# Altium schematic sheet Sheet_1.schdoc
size 296 x 161 mm
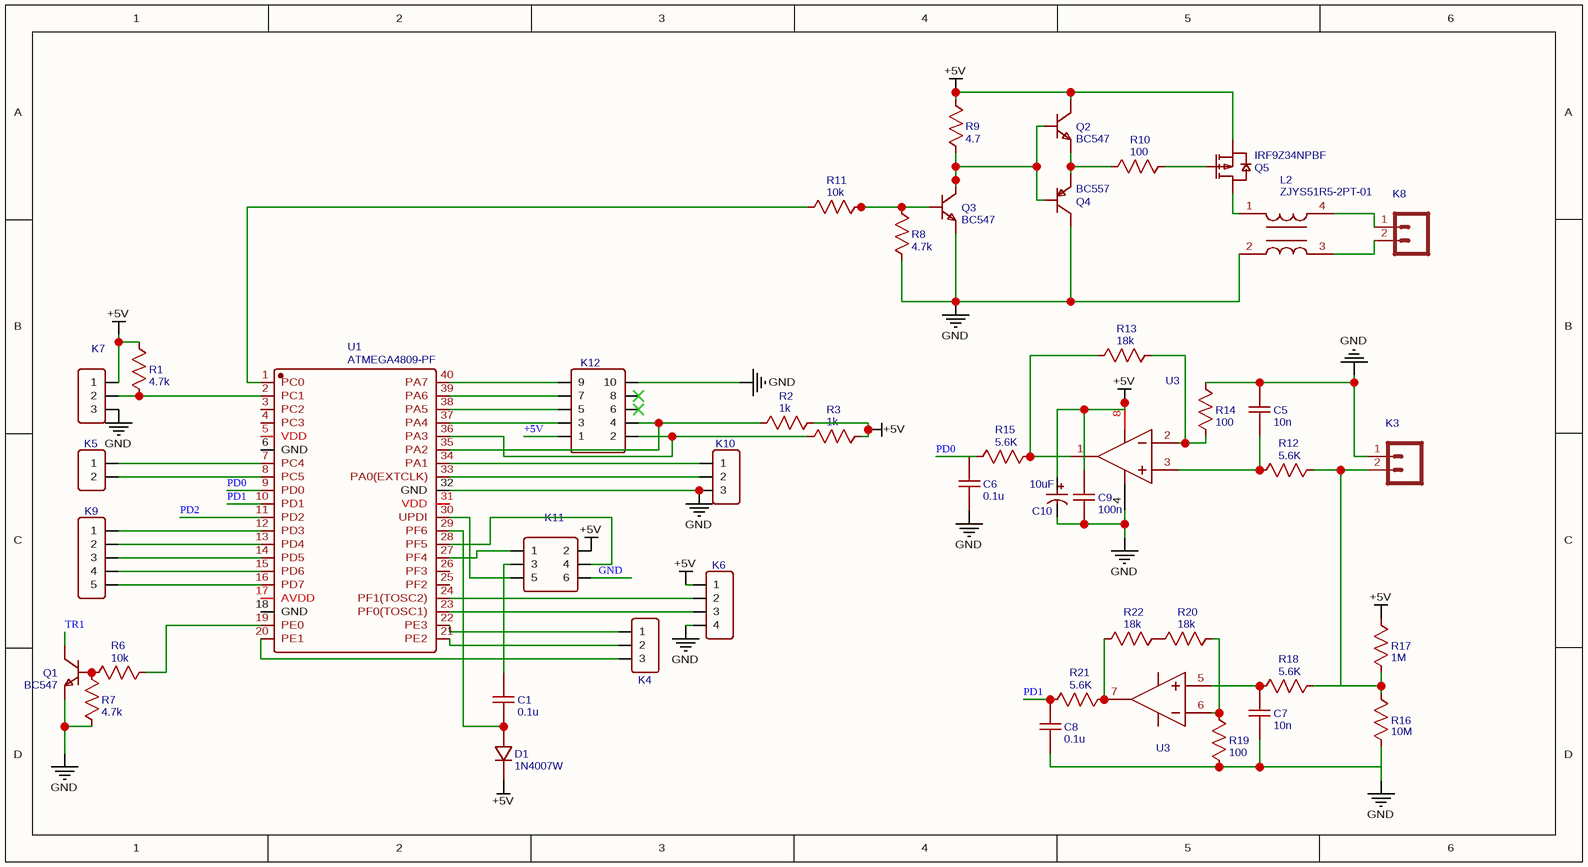
[diagram p0: Sheet_1.schdoc]

## Parts
(Parts that share a designator on the sheet are numbered #1, #2 ... from top to bottom, then left to right.)
C1  0.1u  [C0805]
C5  10n  [C0805]
C6  0.1u  [C0805]
C7  10n  [C0805]
C8  0.1u  [C0805]
C9  100n  [C0805]
C10  10uF  [CAP-TH_BD4.0-P1.50-D0.8-FD]
D1  1N4007W  [SOD-123_L2.8-W1.8-LS3.7-RD]
K3  M025MM  [SCREWTERMINAL-5MM-2]  (value not drawn)
K4  HDR-M-2.54_1x3  [HDR-M-2.54_1X3]  (value not drawn)
K5  HDR-M-2.54_1x2  [HDR-M-2.54_1X2]  (value not drawn)
K6  HDR-M-2.54_1x4  [HDR-M-2.54_1X4]  (value not drawn)
K7  HDR-M-2.54_1x3  [HDR-M-2.54_1X3]  (value not drawn)
K8  M025MM  [SCREWTERMINAL-5MM-2]  (value not drawn)
K9  HDR-M-2.54_1x5  [HDR-M-2.54_1X5]  (value not drawn)
K10  HDR-M-2.54_1x3  [HDR-M-2.54_1X3]  (value not drawn)
K11  HDR-M-2.54_2x3  [HDR-M-2.54_2X3]  (value not drawn)
K12  HDR-M-2.54_2x5  [HDR-M-2.54_2X5]  (value not drawn)
L2  ZJYS51R5-2PT-01  [FILTER-SMD_4P-L6.9-W5.5-P2.54-LS9.0-TL]
Q1  BC547  [TO-92-3_L4.8-W3.7-P1.27-L]
Q2  BC547  [TO-92-3_L4.8-W3.7-P1.27-L]
Q3  BC547  [TO-92-3_L4.8-W3.7-P1.27-L]
Q4  BC557  [TO-92-3_L4.9-W3.7-P1.27-R]
Q5  IRF9Z34NPBF  [TO-220-3_L10.0-W4.5-P2.54-L]
R1  4.7k  [R0805]
R2  1k  [R0805]
R3  1k  [R0805]
R6  10k  [R0805]
R7  4.7k  [R0805]
R8  4.7k  [R0805]
R9  4.7  [R0805]
R10  100  [R0805]
R11  10k  [R0805]
R12  5.6K  [R0805]
R13  18k  [R0805]
R14  100  [R0805]
R15  5.6K  [R0805]
R16  10M  [R0805]
R17  1M  [R0805]
R18  5.6K  [R0805]
R19  100  [R0805]
R20  18k  [R0805]
R21  5.6K  [R0805]
R22  18k  [R0805]
U1  ATMEGA4809-PF  [PDIP-40_L52.3-W13.8-P2.54-LS15.2-BL]
U3#1  MCP6002M/TR  [SOP-8_L4.9-W3.9-P1.27-LS6.0-BL]  (value not drawn)
U3#2  MCP6002M/TR  [SOP-8_L4.9-W3.9-P1.27-LS6.0-BL]  (value not drawn)

## Nets
+5V: C9.2 C10.1 D1.1 K6.1 K7.1 K11.2 K12.1 Q2.1(C) Q5.3(S) R1.2 R2.2 R3.2 R9.2 R17.2 U3#1.8(VDD)
GND: C5.2 C6.1 C7.1 C8.1 C9.1 C10.2 K3.1 K6.4 K7.3 K10.3 K11.6 K12.10 L2.2 Q1.3(E) Q3.3(E) Q4.1(C) R7.1 R8.1 R14.2 R16.1 R19.1 U1.32(GND) U3#1.4(VSS)
PD0: C6.2 R15.1 U1.9(PD0)
PD1: C8.2 R21.1 U1.10(PD1)
PD2: U1.11(PD2)
TR1: Q1.1(C)
NetC1_1: C1.1 D1.2 K11.4 U1.28(PF5) U1.29(PF6)
NetC1_2: C1.2 K11.3
NetC5_1: C5.1 R12.1 U3#1.3(VINA+)
NetC7_2: C7.2 R18.1 U3#2.5(VINB+)
NetK3_2: K3.2 R12.2 R16.2 R17.1 R18.2
NetK4_1: K4.1 U1.22(PE3)
NetK4_2: K4.2 U1.21(PE2)
NetK4_3: K4.3 U1.20(PE1)
NetK5_1: K5.1 U1.7(PC4)
NetK5_2: K5.2 U1.8(PC5)
NetK6_2: K6.2 U1.24(PF1(TOSC2))
NetK6_3: K6.3 U1.23(PF0(TOSC1))
NetK7_2: K7.2 R1.1 U1.2(PC1)
NetK8_1: K8.1 L2.4
NetK8_2: K8.2 L2.3
NetK9_1: K9.1 U1.12(PD3)
NetK9_2: K9.2 U1.13(PD4)
NetK9_3: K9.3 U1.14(PD5)
NetK9_4: K9.4 U1.15(PD6)
NetK9_5: K9.5 U1.16(PD7)
NetK10_1: K10.1 U1.34(PA1)
NetK10_2: K10.2 U1.33(PA0(EXTCLK))
NetK11_1: K11.1 U1.27(PF4)
NetK11_5: K11.5 U1.30(UPDI)
NetK12_2: K12.2 R3.1 U1.36(PA3)
NetK12_3: K12.3 U1.37(PA4)
NetK12_4: K12.4 R2.1 U1.35(PA2)
NetK12_5: K12.5 U1.38(PA5)
NetK12_7: K12.7 U1.39(PA6)
NetK12_9: K12.9 U1.40(PA7)
NetL2_1: L2.1 Q5.2(D)
NetQ1_2: Q1.2(B) R6.1 R7.2
NetQ2_2: Q2.2(B) Q3.1(C) Q4.2(B) R9.1
NetQ2_3: Q2.3(E) Q4.3(E) R10.1
NetQ3_2: Q3.2(B) R8.2 R11.2
NetQ5_1: Q5.1(G) R10.2
NetR6_2: R6.2 U1.19(PE0)
NetR11_1: R11.1 U1.1(PC0)
NetR13_1: R13.1 R15.2 U3#1.1(VOUTA)
NetR13_2: R13.2 R14.1 U3#1.2(VINA-)
NetR19_2: R19.2 R20.2 U3#2.6(VINB-)
NetR20_1: R20.1 R22.2
NetR21_2: R21.2 R22.1 U3#2.7(VOUTB)

Not connected (* = marked no-connect by the designer): K12 6* 8*; U1 3(PC2) 4(PC3) 5(VDD) 6(GND) 17(AVDD) 18(GND) 25(PF2) 26(PF3) 31(VDD)

## Library data of the parts
C1 C6 C8 = 0.1u: nameAlias: Value(F); Contributor: LCEDA_Lib; spicePre: C; spiceSymbolName: C_0805_US
C5 C7 = 10n: nameAlias: Value(F); Contributor: LCEDA_Lib; spicePre: C; spiceSymbolName: C_0805_US
C9 = 100n: nameAlias: Value(F); Contributor: LCEDA_Lib; spicePre: C; spiceSymbolName: C_0805_US
C10 = 10uF: BOM_Manufacturer: Rubycon; BOM_Manufacturer Part: 25MS710MEFC4X7; nameAlias: Capacitance; BOM_Supplier: LCSC; BOM_Supplier Part: C88739; BOM_JLCPCB Part Class: Extended Part; spicePre: C; spiceSymbolName: 25MS710MEFC4X7
D1 = 1N4007W: BOM_Manufacturer: BLUE ROCKET; Contributor: LCEDA_Lib; BOM_Supplier: LCSC; BOM_Supplier Part: C328592; BOM_Manufacturer Part: 1N4007W; spicePre: D; spiceSymbolName: 1N4007W
K3 K8 = M025MM: description: Standard 2-pin 0.1 header. Use with; Contributor: SparkFun; spicePre: J; spiceSymbolName: M025MM
K4 K7 K10 = HDR-M-2.54_1x3: Contributor: LCEDA_Lib; BOM_Supplier Part: C180248; BOM_Supplier: LCSC; spicePre: J; spiceSymbolName: HDR-M-2.54_1x3
K5 = HDR-M-2.54_1x2: Contributor: LCEDA_Lib; BOM_Supplier Part: C124375; BOM_Supplier: LCSC; spicePre: J; spiceSymbolName: HDR-M-2.54_1x2
K6 = HDR-M-2.54_1x4: Contributor: LCEDA_Lib; BOM_Supplier Part: C124378; BOM_Supplier: LCSC; spicePre: J; spiceSymbolName: HDR-M-2.54_1x4
K9 = HDR-M-2.54_1x5: Contributor: LCEDA_Lib; BOM_Supplier Part: C358687; BOM_Supplier: LCSC; spicePre: J; spiceSymbolName: HDR-M-2.54_1x5
K11 = HDR-M-2.54_2x3: Contributor: LCEDA_Lib; BOM_Supplier Part: C65114; BOM_Supplier: LCSC; spicePre: J; spiceSymbolName: HDR-M-2.54_2x3
K12 = HDR-M-2.54_2x5: Contributor: LCEDA_Lib; BOM_Supplier Part: C178292; BOM_Supplier: LCSC; spicePre: J; spiceSymbolName: HDR-M-2.54_2x5
L2 = ZJYS51R5-2PT-01: BOM_Manufacturer: TDK; BOM_Supplier: LCSC; BOM_Manufacturer Part: ZJYS51R5-2PT-01; BOM_Supplier Part: C14635; spicePre: L; spiceSymbolName: ZJYS51R5-2PT-01
Q1-Q3 = BC547: BOM_Manufacturer: CJ（江苏长电/长晶）; Contributor: LCSC; BOM_Supplier: LCSC; BOM_Supplier Part: C2910381; BOM_Manufacturer Part: BC547; link: https://atta.szlcsc.com/upload/public/pdf/source/20220322/35437BB3E522E0C3E451097265A180DC.pdf; spicePre: Q; spiceSymbolName: BC547
Q4 = BC557: BOM_Manufacturer: CJ; Contributor: LCSC; BOM_Supplier Part: C180418; BOM_Supplier: LCSC; BOM_Manufacturer Part: BC557; BOM_JLCPCB Part Class: Extended Part; spicePre: Q; spiceSymbolName: BC557
Q5 = IRF9Z34NPBF: BOM_Manufacturer: Infineon Technologies; Contributor: LCSC; BOM_Supplier: LCSC; BOM_Supplier Part: C500523; BOM_Manufacturer Part: IRF9Z34NPBF; BOM_JLCPCB Part Class: Extended Part; spicePre: Q; spiceSymbolName: IRF9Z34NPBF
R1 R7 R8 = 4.7k: nameAlias: Value(Ω); Contributor: LCEDA_Lib; spicePre: R; spiceSymbolName: R_0805_US
R2 R3 = 1k: nameAlias: Value(Ω); Contributor: LCEDA_Lib; spicePre: R; spiceSymbolName: R_0805_US
R6 R11 = 10k: nameAlias: Value(Ω); Contributor: LCEDA_Lib; spicePre: R; spiceSymbolName: R_0805_US
R9 = 4.7: nameAlias: Value(Ω); Contributor: LCEDA_Lib; spicePre: R; spiceSymbolName: R_0805_US
R10 R14 R19 = 100: nameAlias: Value(Ω); Contributor: LCEDA_Lib; spicePre: R; spiceSymbolName: R_0805_US
R12 R15 R18 R21 = 5.6K: nameAlias: Value(Ω); Contributor: LCEDA_Lib; spicePre: R; spiceSymbolName: R_0805_US
R13 R20 R22 = 18k: nameAlias: Value(Ω); Contributor: LCEDA_Lib; spicePre: R; spiceSymbolName: R_0805_US
R16 = 10M: nameAlias: Value(Ω); Contributor: LCEDA_Lib; spicePre: R; spiceSymbolName: R_0805_US
R17 = 1M: nameAlias: Value(Ω); Contributor: LCEDA_Lib; spicePre: R; spiceSymbolName: R_0805_US
U1 = ATMEGA4809-PF: BOM_Manufacturer: MICROCHIP(美国微芯); Contributor: LCSC; BOM_Supplier: LCSC; BOM_Supplier Part: C1337387; BOM_Manufacturer Part: ATMEGA4809-PF; BOM_JLCPCB Part Class: Extended Part; spicePre: U; spiceSymbolName: ATMEGA4809-PF
U3#1 U3#2 = MCP6002M/TR: BOM_Manufacturer: HGSEMI; subpart_no: 1; BOM_Supplier: LCSC; BOM_Supplier Part: C444396; BOM_Manufacturer Part: MCP6002M/TR; BOM_JLCPCB Part Class: Extended Part; spicePre: U; spiceSymbolName: MCP6002M/TR